# Altium schematic sheet mic_amp.SchDoc
size A4; SheetNumber: 8; SheetTotal: 11
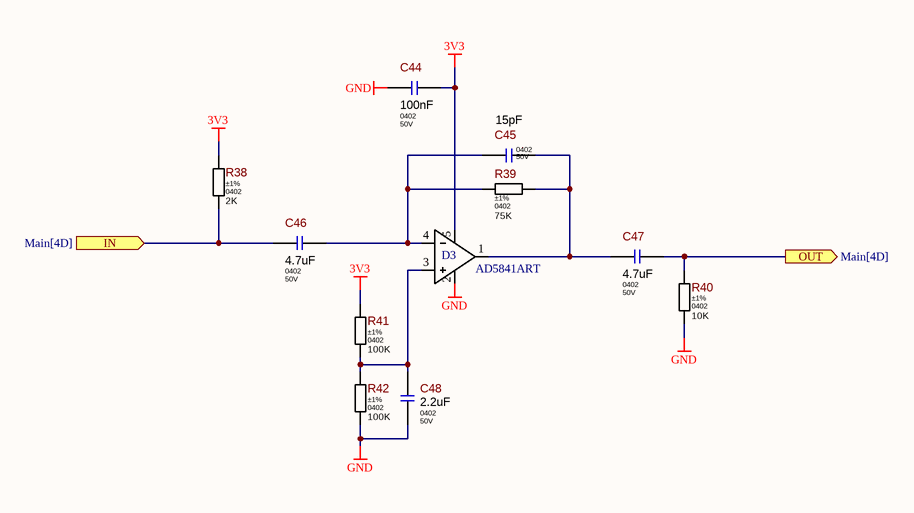
[diagram p0: mic_amp.SchDoc]

## Parts
C44  Package: 0402  Voltage: 50V  [Cap_0402]  (hidden comment: 100nF)
C45  Package: 0402  Voltage: 50V  [Cap_0402]  (hidden comment: 15pF)
C46  Package: 0402  Voltage: 50V  [Cap_0402]  (hidden comment: 4.7uF)
C47  Package: 0402  Voltage: 50V  [Cap_0402]  (hidden comment: 4.7uF)
C48  Package: 0402  Voltage: 50V  [Cap_0402]  (hidden comment: 2.2uF)
D3  AD5841ART  [SOT-23-5]
R38  value 2K  Tolerance: ±1%  Package: 0402  [Res_0402]  (hidden comment: Res_0402_2K)
R39  value 75K  Tolerance: ±1%  Package: 0402  [Res_0402]  (hidden comment: Res_0402_75K)
R40  value 10K  Tolerance: ±1%  Package: 0402  [Res_0402]  (hidden comment: Res_0402_10K)
R41  value 100K  Tolerance: ±1%  Package: 0402  [Res_0402]  (hidden comment: Res_0402_100K)
R42  value 100K  Tolerance: ±1%  Package: 0402  [Res_0402]  (hidden comment: Res_0402_100K)

## Ports
IN (in, see Main[4D]), OUT (out, see Main[4D])

## Nets
3V3: C44.2 D3.5 R38.1 R41.1
GND: C44.1 C48.2 D3.2 R40.2 R42.2
IN: C46.1 R38.2 ; port IN
OUT: C47.2 R40.1 ; port OUT
NetC45_1: C45.1 C46.2 D3.4 R39.1
NetC45_2: C45.2 C47.1 D3.1 R39.2
NetC48_1: C48.1 D3.3 R41.2 R42.1

## Library data of the parts
C44 = Cap_0402_100nF: 100nF 50V  ±25% 0402 Ceramic Capacitor; Component Type: SMD; Tolerance: ±25%; ComponentLink1URL: https://search.murata.co.jp/Ceramy/image/img/A01X/G101/ENG/GRM31CR60J107ME39-01.pdf; ComponentLink1Description: Datasheet; Value: 100nF
C45 = Cap_0402_15pF: 15pF 50V  ±25% 0402 Ceramic Capacitor; Component Type: SMD; Tolerance: ±25%; ComponentLink1URL: https://search.murata.co.jp/Ceramy/image/img/A01X/G101/ENG/GRM31CR60J107ME39-01.pdf; ComponentLink1Description: Datasheet; Value: 15pF
C46 C47 = Cap_0402_4.7uF: 4.7uF 50V  ±25% 0402 Ceramic Capacitor; Component Type: SMD; Tolerance: ±25%; ComponentLink1URL: https://search.murata.co.jp/Ceramy/image/img/A01X/G101/ENG/GRM31CR60J107ME39-01.pdf; ComponentLink1Description: Datasheet; Value: 4.7uF
C48 = Cap_0402_2.2uF: 2.2uF 50V  ±25% 0402 Ceramic Capacitor; Component Type: SMD; Tolerance: ±25%; ComponentLink1URL: https://search.murata.co.jp/Ceramy/image/img/A01X/G101/ENG/GRM31CR60J107ME39-01.pdf; ComponentLink1Description: Datasheet; Value: 2.2uF
D3 = AD5841ART: CMOS Rail to Rail 1Mhz 2.7-5.5v
R38 = Res_0402_2K: ±1% 1/16W 0402; Power Rating: 0.062W; Voltage: 50V; ComponentLink1URL: https://www.yageo.com/upload/media/product/productsearch/datasheet/rchip/PYu-RC_Group_51_RoHS_L_10.pdf; ComponentLink1Description: Datasheet
R39 = Res_0402_75K: ±1% 1/16W 0402; Power Rating: 0.062W; Voltage: 50V; ComponentLink1URL: https://www.yageo.com/upload/media/product/productsearch/datasheet/rchip/PYu-RC_Group_51_RoHS_L_10.pdf; ComponentLink1Description: Datasheet
R40 = Res_0402_10K: ±1% 1/16W 0402; Power Rating: 0.062W; Voltage: 50V; ComponentLink1URL: https://www.yageo.com/upload/media/product/productsearch/datasheet/rchip/PYu-RC_Group_51_RoHS_L_10.pdf; ComponentLink1Description: Datasheet
R41 R42 = Res_0402_100K: ±1% 1/16W 0402; Power Rating: 0.062W; Voltage: 50V; ComponentLink1URL: https://www.yageo.com/upload/media/product/productsearch/datasheet/rchip/PYu-RC_Group_51_RoHS_L_10.pdf; ComponentLink1Description: Datasheet